# Altium project Placa 3 (ESP32).PrjPcb
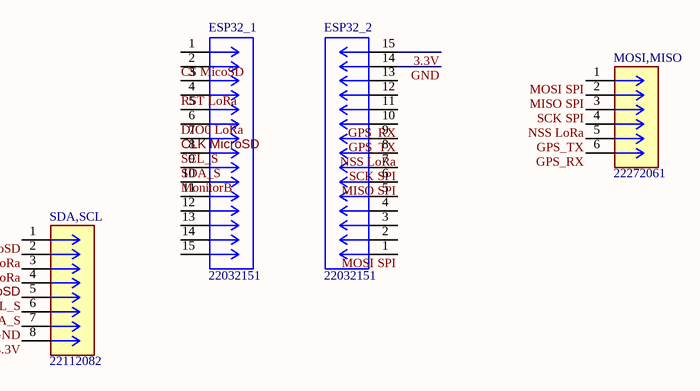
[diagram p0: Placa3.SchDoc]
1 sheet, 4 parts. Net scope: global (net labels, ports and power ports of the same name join across sheets).
Board file: Placa3.PcbDoc

## Sheet Placa3.SchDoc
size A4; SheetNumber: 1; SheetTotal: 1

### Parts
ESP32_1  22032151  [CONN15X1_22032151_MOL]
ESP32_2  22032151  [CONN15X1_22032151_MOL]
MOSI,MISO  22272061  [CONN_AE-6410-06A_MOL]
SDA,SCL  22112082  [CONN_A-6373-08A_MOL]

### Nets
3.3V: ESP32_2.15 SDA,SCL.8
CLK MicroSD: ESP32_1.8 SDA,SCL.4
CS MicoSD: ESP32_1.3 SDA,SCL.1
DIO0 LoRa: ESP32_1.7 SDA,SCL.3
GND: ESP32_2.14 SDA,SCL.7
GPS_RX: ESP32_2.10 MOSI,MISO.6
GPS_TX: ESP32_2.9 MOSI,MISO.5
MISO SPI: ESP32_2.6 MOSI,MISO.2
MonitorB: ESP32_1.11
MOSI SPI: ESP32_2.1 MOSI,MISO.1
NSS LoRa: ESP32_2.8 MOSI,MISO.4
RST LoRa: ESP32_1.5 SDA,SCL.2
SCK SPI: ESP32_2.7 MOSI,MISO.3
SCL_S: ESP32_1.9 SDA,SCL.5
SDA_S: ESP32_1.10 SDA,SCL.6

Not connected (* = marked no-connect by the designer): ESP32_1 1 2 4 6 12 13 14 15; ESP32_2 2 3 4 5 11 12 13

### Library data of the parts
ESP32_1 ESP32_2 = 22032151: Conn Unshrouded Header HDR 15 POS 2.54mm Solder ST Thru-Hole KKÂ® Bag; MF: Molex; SnapEDA_Link: https://www.snapeda.com/parts/22032151/Molex/view-part/?ref=snap; Package: None; Value: *; MP: 22032151; Check_prices: https://www.snapeda.com/parts/22032151/Molex/view-part/?ref=eda
SDA,SCL = 22112082: KKÂ® 254 Solid Header, Vertical, with Friction Lock, 8 Circuits, Gold (Au) Plating; MF: Molex; SnapEDA_Link: https://www.snapeda.com/parts/22-11-2082/Molex/view-part/?ref=snap; Package: None; Value: *; MP: 22-11-2082; Check_prices: https://www.snapeda.com/parts/22-11-2082/Molex/view-part/?ref=eda
MOSI,MISO = 22272061: Package: None; Price: None; Value: *; MP: 22272061; Availability: Unavailable